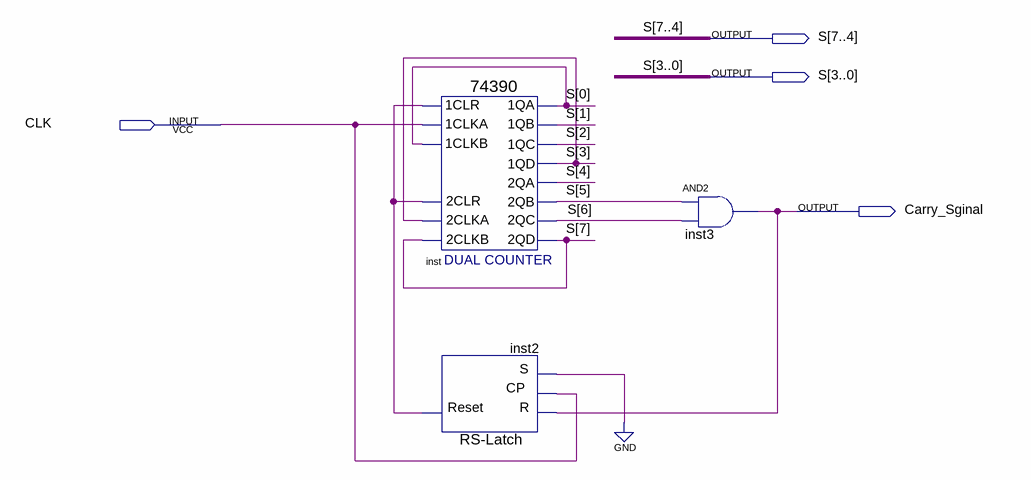
[diagram p0: schematic sheet]
// Quartus schematic Count_S.bdf as structural Verilog: 3 symbols, 4 pins
module Count_S (
  input  CLK,
  output [7:0] S,
  output Carry_Sginal
);

  wire inst2_reset;

  \74390  inst (
    .\2CLKA (S[3]), .\2CLR (inst2_reset), .\2CLKB (S[7]), .\1CLR (inst2_reset), .\1CLKA (CLK),
    .\1CLKB (S[0]), .\1QA (S[0]), .\1QB (S[1]), .\1QC (S[2]), .\1QD (S[3]), .\2QA (S[4]), .\2QB (S[5]),
    .\2QC (S[6]), .\2QD (S[7]));
  \RS-Latch  inst2 (.R(Carry_Sginal), .CP(CLK), .S(1'b0), .Reset(inst2_reset));
  and inst3 (Carry_Sginal, S[5], S[6]);
endmodule
